# Altium schematic sheet MainBoard_Model_Ra.SchDoc
size A4
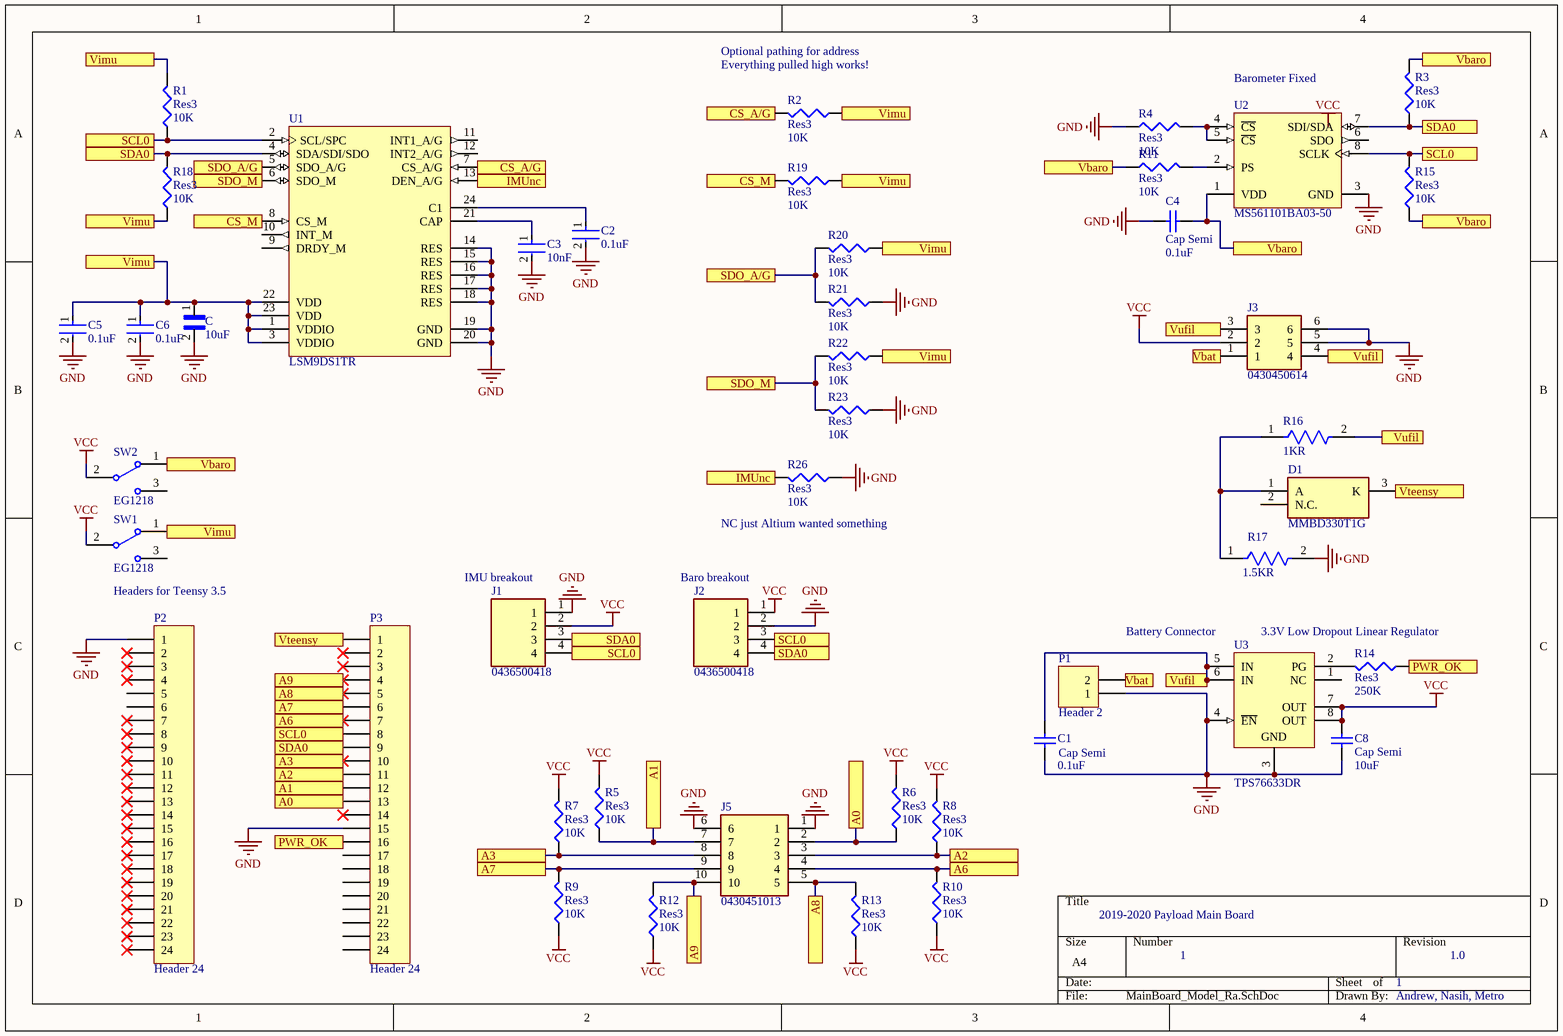
[diagram p0: MainBoard_Model_Ra.SchDoc]

## Parts
C  10uF  [CAPC3216X110N]
C1  Cap Semi  value 0.1uF  [C1206]
C2  0.1uF  [FP-C0603C-CF-MFG]
C3  10nF  [FP-CL10-IPC_C]
C4  Cap Semi  value 0.1uF  [C1206]
C5  0.1uF  [FP-C0603C-CF-MFG]
C6  0.1uF  [FP-C0603C-CF-MFG]
C8  Cap Semi  value 10uF  [C1206]
D1  MMBD330T1G  [SOT65P220X100-3N]
J1  0436500418  [0436500418]
J2  0436500418  [0436500418]
J3  0430450614  [0430450614]
J5  0430451013  [0430451013]
P1  Header 2  [HDR1X2]
P2  Header 24  [HDR1X24]
P3  Header 24  [HDR1X24]
R1  Res3  value 10K  [J1-0603]
R2  Res3  value 10K  [J1-0603]
R3  Res3  value 10K  [J1-0603]
R4  Res3  value 10K  [J1-0603]
R5  Res3  value 10K  [J1-0603]
R6  Res3  value 10K  [J1-0603]
R7  Res3  value 10K  [J1-0603]
R8  Res3  value 10K  [J1-0603]
R9  Res3  value 10K  [J1-0603]
R10  Res3  value 10K  [J1-0603]
R11  Res3  value 10K  [J1-0603]
R12  Res3  value 10K  [J1-0603]
R13  Res3  value 10K  [J1-0603]
R14  Res3  value 250K  [J1-0603]
R15  Res3  value 10K  [J1-0603]
R16  1KR  [FP-ESR18-IPC_C]
R17  1.5KR  [FP-RT1206-MFG]
R18  Res3  value 10K  [J1-0603]
R19  Res3  value 10K  [J1-0603]
R20  Res3  value 10K  [J1-0603]
R21  Res3  value 10K  [J1-0603]
R22  Res3  value 10K  [J1-0603]
R23  Res3  value 10K  [J1-0603]
R26  Res3  value 10K  [J1-0603]
SW1  EG1218  [ESWI-EG1218_V]
SW2  EG1218  [ESWI-EG1218_V]
U1  LSM9DS1TR  [STM-LGA-24_3500X3000X1000]
U2  MS561101BA03-50  [MSI-MS561101BA03-50-8_V]
U3  TPS76633DR  [D0008A_N]

## Ports
A0, A1, A2, A3, A6, A7, A8, A9, CS_A/G, CS_M, IMUnc, PWR_OK, SCL0, SDA0, SDO_A/G, SDO_M, Vbaro, Vbat, Vimu, Vteensy, Vufil

## Nets
GND: C.2 C1.1 C2.2 C3.2 C4.2 C5.2 C6.2 C8.1 J1.1 J2.2 J3.5 J3.6 J5.1 J5.6 P1.1 P2.1 P3.15 R4.1 R17.2 R21.1 R23.1 R26.1 U1.14(RES) U1.15(RES) U1.16(RES) U1.17(RES) U1.18(RES) U1.19(GND) U1.20(GND) U2.3(GND) U3.3(GND) U3.4(~{EN})
VCC: C8.2 J1.2 J2.1 J3.2 R5.2 R6.2 R7.2 R8.2 R9.1 R10.1 R12.1 R13.1 SW1.2(COM) SW2.2(COM) U3.7(OUT) U3.8(OUT)
A0: J5.2 P3.13 R6.1 ; port A0
A1: J5.7 P3.12 R5.1 ; port A1
A2: J5.3 P3.11 R8.1 ; port A2
A3: J5.8 P3.10 R7.1 ; port A3
A6: J5.4 P3.7 R10.2 ; port A6
A7: J5.9 P3.6 R9.2 ; port A7
A8: J5.5 P3.5 R13.2 ; port A8
A9: J5.10 P3.4 R12.2 ; port A9
CS_A/G: R2.2 U1.7(CS_A/G) ; port CS_A/G
CS_M: R19.2 U1.8(CS_M) ; port CS_M
IMUnc: R26.2 U1.13(DEN_A/G) ; port IMUnc
PWR_OK: P3.16 R14.1 ; port PWR_OK
SCL0: J1.4 J2.3 P3.8 R1.1 R15.2 U1.2(SCL/SPC) U2.8(SCLK) ; port SCL0
SDA0: J1.3 J2.4 P3.9 R3.1 R18.2 U1.4(SDA/SDI/SDO) U2.7(SDI/SDA) ; port SDA0
SDO_A/G: R20.2 R21.2 U1.5(SDO_A/G) ; port SDO_A/G
SDO_M: R22.2 R23.2 U1.6(SDO_M) ; port SDO_M
Vbaro: C4.1 R3.2 R11.1 R15.1 SW2.1 U2.1(VDD) ; port Vbaro
Vbat: J3.1 P1.2 ; port Vbat
Vimu: C.1 C5.1 C6.1 R1.2 R2.1 R18.1 R19.1 R20.1 R22.1 SW1.1 U1.1(VDDIO) U1.3(VDDIO) U1.22(VDD) U1.23(VDD) ; port Vimu
Vteensy: D1.3(K) P3.1 ; port Vteensy
Vufil: C1.2 J3.3 J3.4 R16.2 U3.5(IN) U3.6(IN) ; port Vufil
NetC2_1: C2.1 U1.24(C1)
NetC3_1: C3.1 U1.21(CAP)
NetD1_1: D1.1(A) R16.1 R17.1
NetR4_2: R4.2 U2.4(~{CS}) U2.5(~{CS})
NetR11_2: R11.2 U2.2(PS)
NetR14_2: R14.2 U3.2(PG)

Not connected (* = marked no-connect by the designer): D1 2(N.C.); P2 2* 3* 4* 5 6 7* 8* 9* 10* 11* 12* 13* 14* 15* 16* 17* 18* 19* 20* 21* 22* 23* 24*; P3 2* 3* 14* 17 18 19 20 21 22 23 24; SW1 3; SW2 3; U1 9(DRDY_M) 10(INT_M) 11(INT1_A/G) 12(INT2_A/G); U2 6(SDO); U3 1(NC)

## Notes on the sheet
- Optional pathing for address
- (near R2) Everything pulled high works!
- (near U2) Barometer Fixed
- (near J1) IMU breakout
- (near J2) Baro breakout
- (near R26) NC just Altium wanted something
- Headers for Teensy 3.5
- (near U3) Battery Connector
- 3.3V Low Dropout Linear Regulator
- 2019-2020 Payload Main Board
- 1
- 1.0
- Andrew, Nasih, Metro
- Labels drawn without touching a wire or pin: VCC

## Library data of the parts
C = C1206C106K4PACTU: 10ÂµF Â±10% 16V Ceramic Capacitor X5R 1206 _3216 Metric_; MF: KEMET; Digi-Key_Part_Number: 399-5091-1-ND; Digi-Key_Purchase_URL: https://www.digikey.com/product-detail/en/kemet/C1206C106K4PACTU/399-5091-1-ND/1465625?utm_source=snapeda&utm_medium=aggregator&utm_campaign=symbol; Package: 1206 KEMET; MP: C1206C106K4PACTU; Value: *; SnapEDA_Link: https://www.snapeda.com/parts/C1206C106K4PACTU/KEMET/view-part/609620/?ref=snap
C1 C4 C8 = Cap Semi: Capacitor (Semiconductor SIM Model); Published: 8-Jun-2000; LatestRevisionDate: 29-May-2009; LatestRevisionNote: IPC-7351 Footprint Added.; PackageReference: C1206; Publisher: Altium Limited; PackageDescription: Chip Capacitor
C2 C5 C6 = CMP-2006-03068-2: CAP CER 0.1UF 50V 20% X7R 0603; Manufacturer Part Number: C0603C104M5RACTU; Manufacturer: KEMET; Material: Ceramic; Tolerance: 0.2; Value: 0.10 μF; Temperature Coefficient: 30ppm/°C; Automotive Grade: Grade 1; Temperature Range High: +125°C; Voltage Rating: 50 V; Device Class L3: Ceramic Capacitors; Height: 0.87mm; Category: Cap; RoHS: TRUE; Digikey Description: CAP CER 0.1UF 50V 20% X7R 0603; ComponentLink2URL: https://api.kemet.com/component-edge/download/datasheet/C0603C100J5GACAUTO.pdf; Lead Free: Yes; Temperature Range Low: -55°C; Device Class L1: Passive Components; ComponentLink2Description: Datasheet; Temperature Characteristic: X7R; Automotive: Yes; Temperature: -55°C to +125°C; Octopart: https://octopart.com/c0603c104m5ractu-kemet-11855687; Device Class L2: Capacitors; Package: C0603C-CF; Mouser Description: Multilayer Ceramic Capacitors MLCC - SMD/SMT 50volts 0.1uF X7R 20%; Capacitance: 0.10 μF
C3 = CMP-13271-000724-1: Cap Ceramic 10nF 25V X7R ±10% Pad SMD 0603 +125°C T/R; Mount: Surface Mount; Case/Package: 0603; Capacitance: 10nF; Tolerance: 10%; Thickness: 0.035inch; Features: Soft Termination; Max Operating Temperature: 125°C; Case Code (Metric): 1608; Width: 0.031inch; Case Code (Imperial): 0603; Min Operating Temperature: -55°C; Packaging: Tape and Reel; Voltage Rating: 25V; Length: 0.063inch; Ratings: AEC-Q200
D1 = MMBD330T1G: Diode; Manufacturer_Name: ON Semiconductor; Datasheet Link: http://www.onsemi.com/pub/Collateral/MMBD330T1-D.PDF; Height: 1mm; Manufacturer_Part_Number: MMBD330T1G; Mouser Part Number: 863-MMBD330T1G; Mouser Price/Stock: https://www.mouser.com/Search/Refine.aspx?Keyword=863-MMBD330T1G; Arrow Part Number: MMBD330T1G; Arrow Price/Stock: https://www.arrow.com/en/products/mmbd330t1g/on-semiconductor
J1 J2 = 0436500418: Connector; Manufacturer_Name: Molex; Datasheet Link: https://www.molex.com/pdm_docs/sd/436500418_sd.pdf; Height: 9.9mm; Manufacturer_Part_Number: 0436500418; Arrow Part Number: 0436500418; Arrow Price/Stock: https://www.arrow.com/en/products/0436500418/molex
J3 = 0430450614: Connector; Manufacturer_Name: Molex; Datasheet Link: https://www.molex.com/pdm_docs/sd/430450614_sd.pdf; Height: 10.16mm; Manufacturer_Part_Number: 0430450614; Arrow Part Number: 0430450614; Arrow Price/Stock: https://www.arrow.com/en/products/0430450614/molex
J5 = 0430451013: Connector; Manufacturer_Name: Molex; Datasheet Link: https://media.digikey.com/pdf/Data%20Sheets/Molex%20PDFs/PK-70873-05xx_1_N3.pdf; Height: 10.16mm; Manufacturer_Part_Number: 0430451013; Mouser Part Number: N/A; Mouser Price/Stock: https://www.mouser.co.uk/ProductDetail/Molex/0430451013?qs=PBcRNPEHKsr61YxZQctt5w%3D%3D
P1 = Header 2: Header, 2-Pin; LatestRevisionDate: 17-Jul-2002; LatestRevisionNote: Re-released for DXP Platform.; Publisher: Altium Limited
P2 P3 = Header 24: Header, 24-Pin; LatestRevisionDate: 17-Jul-2002; LatestRevisionNote: Re-released for DXP Platform.; Publisher: Altium Limited
R1-R15 R18-R23 R26 = Res3: Resistor; Published: 8-Jun-2000; LatestRevisionDate: 29-May-2009; LatestRevisionNote: IPC-7351 Footprint Added.; PackageReference: J1-0603; Publisher: Altium Limited; PackageDescription: Chip Resistor
R16 = CMP-08839-005364-1: 1kΩ ±1% 0.5W 1206 Anti-Surge Chip Resistor AEC-Q200; Max Power Dissipation: 333mW; Temperature Coefficient: 100ppm/°C; Case Code (Metric): 3216; Case Code (Imperial): 1206; Number of Terminations: 2; Package Quantity: 1; Tolerance: 1%; Packaging: Tape and Reel; Width: 0.063inch; Case/Package: 1206; Resistor Type: Thick Film; Series: ESR; Min Operating Temperature: -55°C; Max Operating Temperature: 155°C; Length: 0.126inch; Resistance: 1kR; Features: Automotive AEC-Q200; RoHS Compliant: Yes; Height: 0.026inch
R17 = CMP-2003-04305-2: RES SMD 1.5K OHM 1% 1/4W 1206; Manufacturer: Yageo; Manufacturer Part Number: RT1206FRE071K5L; Resistance: 1.5KΩ; Value: 1.5KΩ; Power Rating: 0.25W; Tolerance: 0.0002; Temperature Coefficient: 50 ppm/°C; Voltage Rating: 200V; Footprint Url: http://www.yageo.com/exep/pages/download/literatures/PYu-R_Mount_10.pdf; Digikey Description: RES SMD 1.5K OHM 1% 1/4W 1206; Temperature Range Low: -55°C; Device Class L3: Chip SMD Resistors; Automotive: No; Mouser Description: High Precision-High Stability Chip Resistor Thin Film 1206 1.5kOhm 1% Paper T/R; Lead Free: Yes; Octopart: https://octopart.com/rt1206fre071k5l-yageo-1240277; Category: Res; ComponentLink2Description: Datasheet; Package: RT1206; Device Class L2: Resistors; RoHS: TRUE; ComponentLink2URL: http://www.yageo.com/documents/recent/PYu-RT_1-to-0.01_RoHS_L_9.pdf; Temperature Range High: +155°C; Temperature: -55°C to +155°C; Height: 0.65mm; Device Class L1: Passive Components; Series: RT; Composition: Thin Film; Ipc Land Pattern Name: RESC310160X55
SW1 SW2 = CMP-1696-00002-1: Slide Switch, 500 V, -20 to 70 degC, 3-Pin THD, RoHS; Case\Package: SOT-23-5; Output Current: 150 mA; Nominal Output Voltage: 3.3 V; Max Power Dissipation: 250 mW; Min Input Voltage: 4.3 V; Outputs: 1; Max Input Voltage: 8 V; Dropout Voltage: 300 mV; PackageDescription: 3-Pin Through Hole Device, Body 11.6 x 4 mm, Pitch 2.5 mm; ComponentLink1URL: http://www.e-switch.ch/en/; RoHSCompliant: true; Length: 3 mm; ComponentLink1Description: Manufacturer URL; Power Rating: 250 mW; Mount: Surface Mount; Max Operating Temperature: 85 degC; REACH SVHC: No SVHC; Radiation Hardening: No; Height: 1.3 mm; Pins: 5; Max Ouput Current: 150 mA; Output Voltage: 3.3 V; Width: 1.8 mm; Package Quantity: 3000; ComponentLink2URL: https://www.e-switch.com/system/asset/product_line/data_sheet/119/EG.pdf; Min Operating Temperature: -40 degC; ComponentLink2Description: Datasheet; DatasheetVersion: Oct-15; PackageReference: EG1218; Packaging: Tape and Reel
U1 = CMP-2000-06606-1: iNEMO Inertial Module: 3D Accelerometer, 3D Gyroscope, 3D Magnetometer, 1.9 to 3.6 V, -40 to 85 degC, 24-Pin LGA, RoHS, Tape and Reel; Manufacturer: STMicroelectronics; SVHC: NoSVHC(17-Dec-2015); MEMS Module Function: Tri-AxisGyroscope,Tri-AxisAccelerometer,Tri-AxisMagnetometer; Supply Voltage Max: 3.6V; No. of Pins: 24Pins; Gyroscope Range: ±245°/s,±500°/s,±2000°/s; Acceleration Range: ±2g,±4g,±8g,±16g; Supply Voltage Min: 1.9V; Package Description: 24-Pin Plastic Land Grid Array Package, Body 3.65 x 3.15 mm, Pitch 0.43 mm; Manufacturer URL: http://www.st.com/; PartNumber: LSM9DS1; Product Range: -; Packaging: CutTape; Sensor Case Style: LGA; Datasheet URL: http://www2.st.com/content/ccc/resource/technical/document/datasheet/1e/3f/2a/d6/25/eb/48/46/DM00103319.pdf/files/DM00103319.pdf/jcr:content/translations/en.DM00103319.pdf; Package Reference: LGA-24_3500X3000X1000; Mounting Technology: SurfaceMount; Datasheet Version: Rev. 3, 03/2015; MSL: MSL3-168hours
U2 = CMP-2000-05251-1: Barometric Pressure Sensor, with Stainless Steel Cap, 1.8 to 3.6 V, -45 to 85 degC, 8-Pin QFN, RoHS, Tape and Reel; Manufacturer: Measurement Specialties; Operating Pressure Max: 1200mbar; Supply Current: 12.5µA; Supply Voltage Max: 3.6V; Supply Voltage Min: 1.8V; No. of Pins: 8; Connection Size: 0.5mm; SVHC: NoSVHC(20-Jun-2013); Operating Pressure Min: 10mbar; Manufacturer URL: http://www.meas-spec.com/; Operating Temperature Min: -40degC; Pressure Type: Barometric; Package Reference: MS561101BA03-50-8; Datasheet URL: http://www.te.com/commerce/DocumentDelivery/DDEController?Action=srchrtrv&DocNm=MS5611-01BA03&DocType=Data+Sheet&DocLang=English&DocFormat=pdf&PartCntxt=CAT-BLPS0036; Package Description: 8-Pin Surface Mount Device, Body 5 x 3 mm, Pitch 1.25 mm; Sensor Case Style: QFN; Datasheet Version: Sep-15; Operating Temperature Max: 85degC
U3 = CMP-0394-00013-2: Single Output LDO, 250 mA, Fixed 3.3 V Output, 2.7 to 10 V Input, with Low IQ, 8-pin SOIC (D), -40 to 125 degC, Green (RoHS & no Sb/Br); Manufacturer: Texas Instruments; Power Good: TRUE; Vdo(Typ)(mV): 230; Fixed Output Options(V): 3.3; Iout(Max)(A): 0.25; Iq(Typ)(mA): 0.03; Vin(Max)(V): 10; SubFamily: Single Channel LDO; Vin(Min)(V): 2.7; Code_JEDEC: MS-012; ComponentLink1Description: Manufacturer URL; ComponentLink2URL: http://www.ti.com/general/docs/lit/getliterature.tsp?genericPartNumber=TPS76633&fileType=pdf; Mounting Technology: Surface Mount; ComponentLink1URL: http://www.ti.com/; PackageVersion: 4040047-3/M; ComponentLink3Description: Package Specification; DatasheetVersion: SLVS237C; Vout Adj(Max)(V): 3.3; ComponentLink2Description: Datasheet; PackageReference: D0008A; ComponentLink3URL: http://www.ti.com/litv/pdf/msoi002j; Vout Adj(Min)(V): 3.3; PartNumber: TPS76633DR; Eco-Plan: Green (RoHS & no Sb/Br); PackageDescription: 8-Pin Plastic Small Outline, Body 4.9 x 3.9 mm, Pitch 1.27 mm